# EAGLE design stepper_counter (EAGLE 9.6.2)
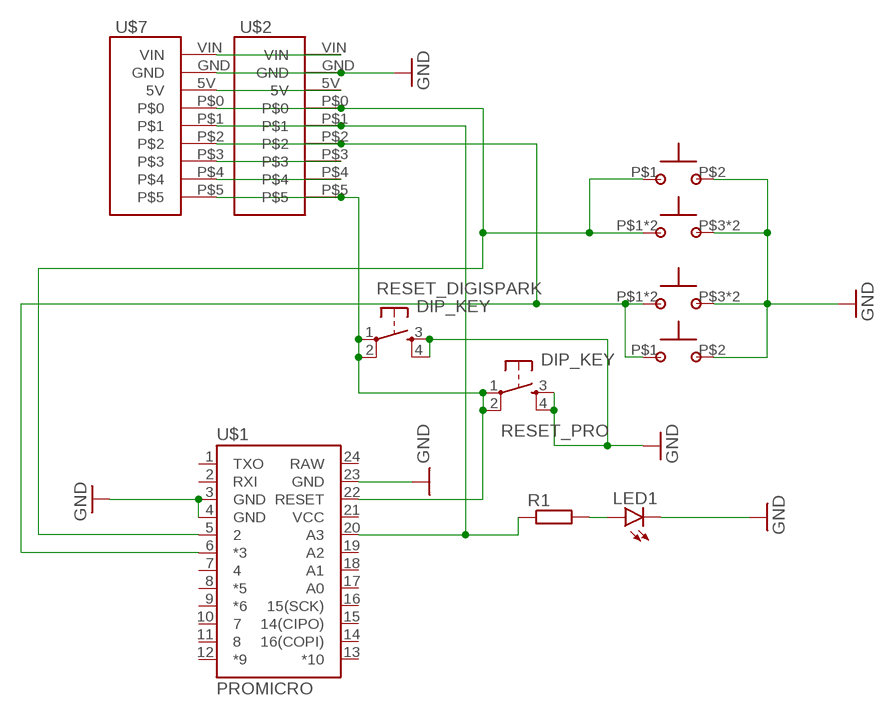
[diagram p0: schematic, sheet 1]

## Parts
LED1  LED3MM  [LED3MM]
R1  R-EU_0207/10  [0207/10]
RESET_DIGISPARK  DIP_KEY  [B3F-10XX]
RESET_PRO  DIP_KEY  [B3F-10XX]
U$1  PROMICRO  [SPARKFUN_PRO_MICRO]
U$2  DIGISPARK  [DIGISPARK]
U$3  RBS040210  [RBS040210]
U$4  RBS040210  [RBS040210]
U$5  SW20D  [SW20D]
U$6  SW20D  [SW20D]
U$7  DIGISPARK_USB  [DIGISPARK_USB]

## Nets
GND: LED1.K(C) RESET_DIGISPARK.3(S) RESET_DIGISPARK.4(S1) RESET_PRO.3(S) RESET_PRO.4(S1) U$1.3(GND) U$1.4(GND) U$1.23(GND) U$2.GND U$3.P$3 U$3.P$4 U$4.P$3 U$4.P$4 U$5.P$2 U$6.P$2 U$7.GND
N$1: R1.1 U$1.20(A3) U$2.P$1 U$7.P$1
N$2: LED1.A R1.2
N$3: RESET_DIGISPARK.1(P) RESET_DIGISPARK.2(P1) RESET_PRO.1(P) RESET_PRO.2(P1) U$1.22(RESET) U$2.P$5 U$7.P$5
N$4: U$2.VIN U$7.VIN
N$5: U$2.5V U$7.5V
N$6: U$2.P$3 U$7.P$3
N$7: U$1.6(*3) U$2.P$2 U$4.P$1 U$4.P$2 U$6.P$1 U$7.P$2
N$8: U$1.5 U$2.P$0 U$3.P$1 U$3.P$2 U$5.P$1 U$7.P$0
N$9: U$2.P$4 U$7.P$4
Unconnected: U$1.1(TXO) U$1.2(RXI) U$1.7 U$1.8(*5) U$1.9(*6) U$1.10 U$1.11 U$1.12(*9) U$1.13(*10) U$1.14(16(COPI)) U$1.15(14(CIPO)) U$1.16(15(SCK)) U$1.17(A0) U$1.18(A1) U$1.19(A2)

## Power pins joined to a net without a drawn wire
RAW: U$1.24(RAW)
VCC: U$1.21(VCC)

## Library data of the parts
LED1 = for_key:LED: LED OSRAM: - CHIPLED LG R971, LG N971, LY N971, LG Q971, LY Q971, LO R971, LY R971 LH N974, LH R974 LS Q976, LO Q976, LY Q976 LO Q996 - Hyper CHIPLED LW Q18S LB Q993, LB Q99A, LB R99A - SideLED LS A670, LO A670, LY A670, LG A670, LP A670 LB A673, LV A673, LT A673, LW A673 LH A674 LY A675 LS A676, LA A676, LO A676, LY A676, LW A676 LS A679, LY A679, LG A679 - Hyper Micro SIDELED® LS Y876, LA Y876, LO Y876, LY Y876 LT Y87S - SmartLED LW L88C, LW L88S LB L89C, LB L89S, LG L890 LS L89K, LO L89K, LY L89K LS L896, LA L896, LO L896, LY L896 - TOPLED LS T670, LO T670, LY T670, LG T670, LP T670 LSG T670, LSP T670, LSY T670, LOP T670, LYG T670 LG T671, LOG T671, LSG T671 LB T673, LV T673, LT T673, LW T673 LH T674 LS T676, LA T676, LO T676, LY T676, LB T676, LH T676, LSB T676, LW T676 LB T67C, LV T67C, LT T67C, LS T67K, LO T67K, LY T67K, LW E67C LS E67B, LA E67B, LO E67B, LY E67B, LB E67C, LV E67C, LT E67C LW T67C LS T679, LY T679, LG T679 LS T770, LO T770, LY T770, LG T770, LP T770 LB T773, LV T773, LT T773, LW T773 LH T774 LS E675, LA E675, LY E675, LS T675 LS T776, LA T776, LO T776, LY T776, LB T776 LHGB T686 LT T68C, LB T68C - Hyper Mini TOPLED® LB M676 - Mini TOPLED Santana® LG M470 LS M47K, LO M47K, LY M47K Source: http://www.osram.convergy.de LUXEON: - LUMILED® LXK2-PW12-R00, LXK2-PW12-S00, LXK2-PW14-U00, LXK2-PW14-V00 LXK2-PM12-R00, LXK2-PM12-S00, LXK2-PM14-U00 LXK2-PE12-Q00, LXK2-PE12-R00, LXK2-PE12-S00, LXK2-PE14-T00, LXK2-PE14-U00 LXK2-PB12-K00, LXK2-PB12-L00, LXK2-PB12-M00, LXK2-PB14-N00, LXK2-PB14-P00, LXK2-PB14-Q00 LXK2-PR12-L00, LXK2-PR12-M00, LXK2-PR14-Q00, LXK2-PR14-R00 LXK2-PD12-Q00, LXK2-PD12-R00, LXK2-PD12-S00 LXK2-PH12-R00, LXK2-PH12-S00 LXK2-PL12-P00, LXK2-PL12-Q00, LXK2-PL12-R00 Source: www.luxeon.com KINGBRIGHT: KA-3528ASYC Source: www.kingbright.com
R1 = rcl:R-EU_: RESISTOR, European symbol; SPICEPREFIX: R
RESET_DIGISPARK RESET_PRO = for_key:DIP_KEY
U$1 = for_key:PROMICRO
U$2 = for_key:DIGISPARK
U$3 U$4 = for_key:RBS040210
U$5 U$6 = for_key:SW20D
U$7 = for_key:DIGISPARK_USB

## Net classes
0 default: width 0.5 mm, drill 0.3 mm, clearance 0.2 mm

## Board
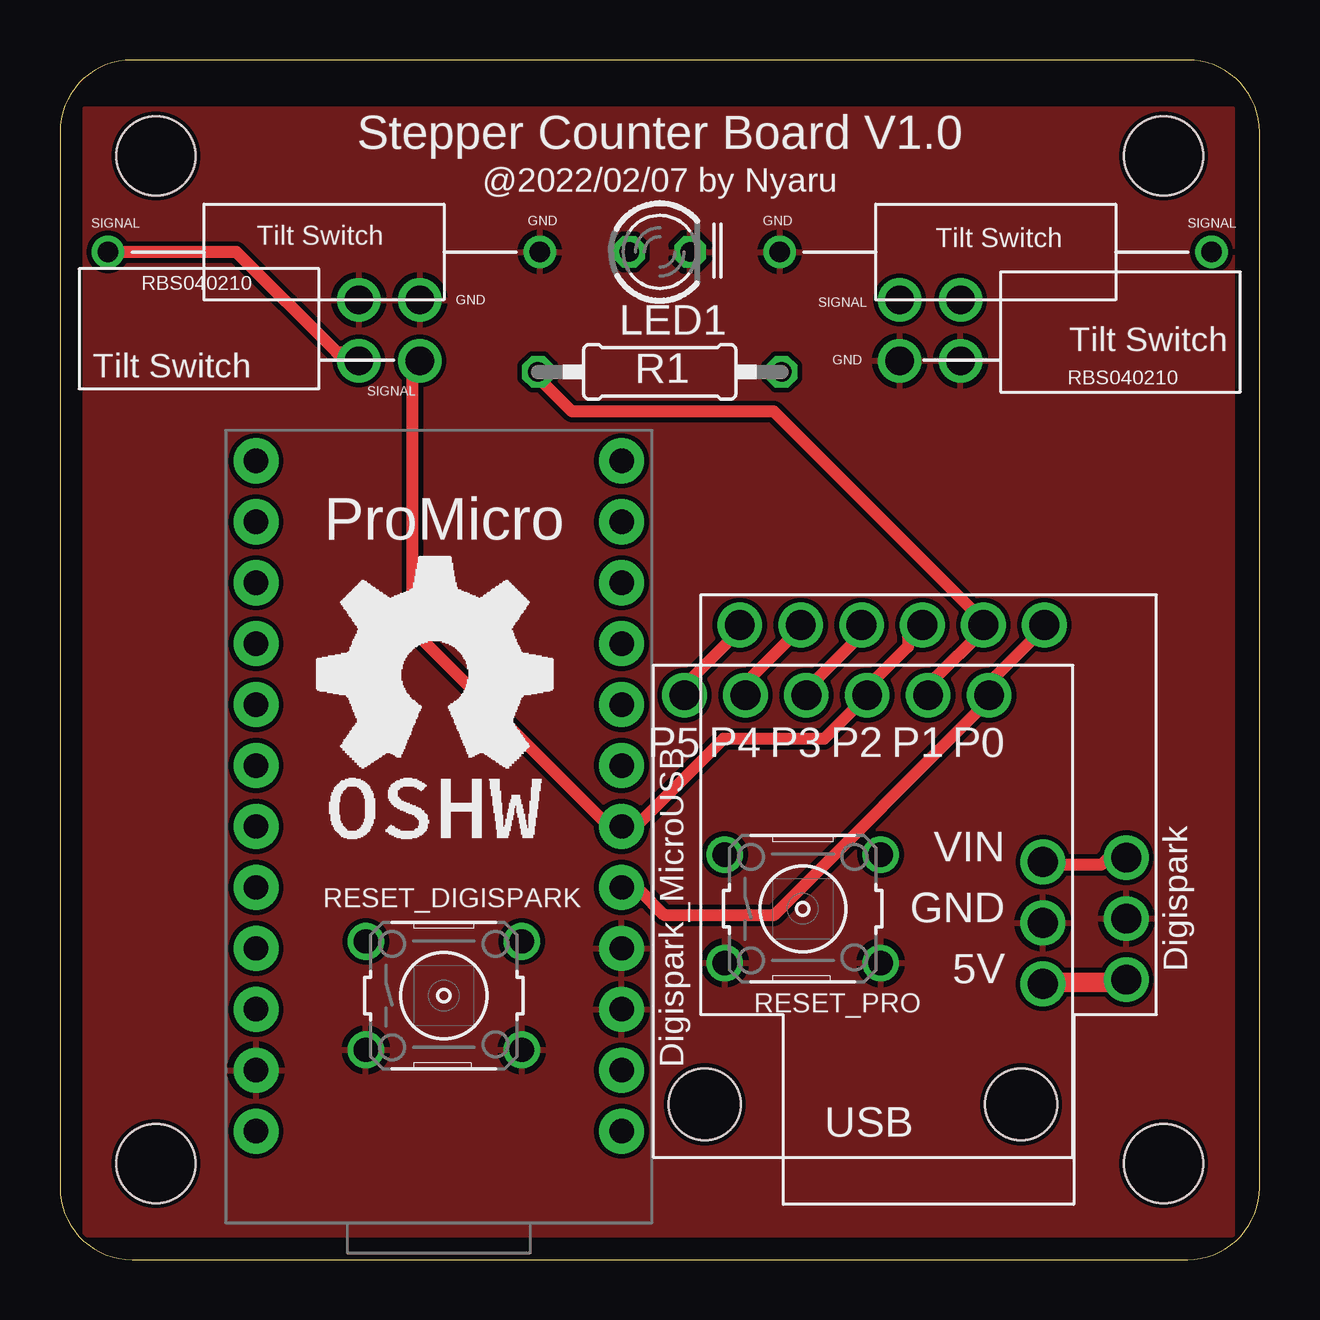
[diagram p1: board, top side]
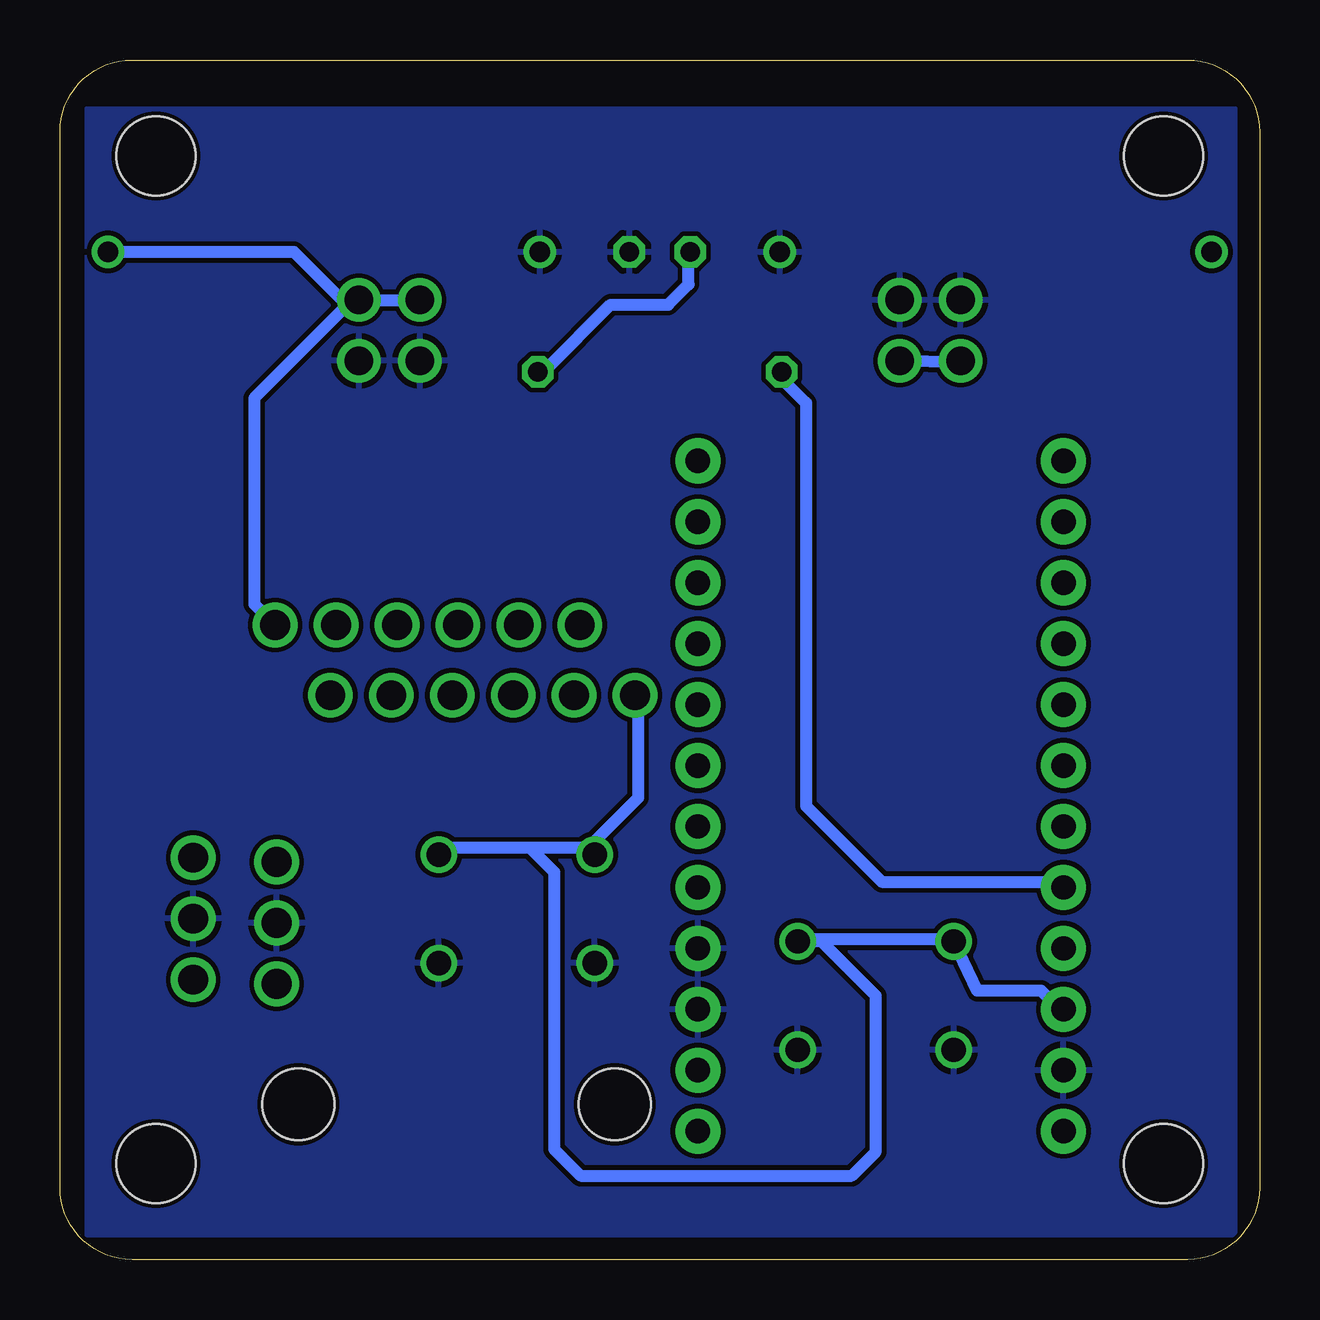
[diagram p2: board, bottom side, seen from below]

Size 50 x 50 mm. Coordinates in mm from the lower left corner, seen from the top.
Outline: 0,47 0,3 arc90 3,0 47,0 arc90 50,3 50,47 arc90 47,50 3,50 arc90 0,47
Copper layers (1*16): Top 0.035mm / dielectric 1.5mm / Bottom 0.035mm
Design rules "PCBGoGo": minimum track width 6mil, minimum drill 0.2mm, track to track 6mil, track to pad 6mil, pad to pad 6mil, via to via 6mil, smd to smd 6mil, copper to edge 0.2mm, drill to drill 6mil, minimum pad ring 10mil, minimum via ring 8mil, stop-mask expansion 4mil, vias tented up to drill 0mil, thermal gap 10mil
Holes 3.3 mm at 4,4 4,46 46,4 46,46

### Footprints (pad centres in the part's own frame; a part is rotated, then mirrored left to right if it is on the bottom)
LED3MM = drill 0.813 octagon: A -1.27,0; K 1.27,0
0207/10 = drill 0.813 octagon: 1 -5.08,0; 2 5.08,0
B3F-10XX = drill 1.016: 1 -3.251,2.261; 2 3.251,2.261; 3 -3.251,-2.261; 4 3.251,-2.261
SPARKFUN_PRO_MICRO = drill 1.016 pad 1.88: 1 -7.62,12.7; 2 -7.62,10.16; 3 -7.62,7.62; 4 -7.62,5.08; 5 -7.62,2.54; 6 -7.62,0; 7 -7.62,-2.54; 8 -7.62,-5.08; 9 -7.62,-7.62; 10 -7.62,-10.16; 11 -7.62,-12.7; 12 -7.62,-15.24; 13 7.62,-15.24; 14 7.62,-12.7; 15 7.62,-10.16; 16 7.62,-7.62; 17 7.62,-5.08; 18 7.62,-2.54; 19 7.62,0; 20 7.62,2.54; 21 7.62,5.08; 22 7.62,7.62; 23 7.62,10.16; 24 7.62,12.7
DIGISPARK = drill 1.24: 5V 1.25,13.28; GND 1.25,10.74; P$0 3.49,1.25; P$1 6.03,1.25; P$2 8.57,1.25; P$3 11.11,1.25; P$4 13.65,1.25; P$5 16.19,1.25; VIN 1.25,8.2 | hole 3: 2.15,18.3; 15.35,18.3
RBS040210 = drill 1.2: P$1 -2.54,2.54; P$2 -2.54,0; P$3 0,0; P$4 0,2.54
SW20D = drill 0.85: P$1 -9,0; P$2 9,0
DIGISPARK_USB = drill 1.24: 5V 1.25,16.03; GND 1.25,13.49; P$0 4.67,1.25; P$1 7.21,1.25; P$2 9.75,1.25; P$3 12.29,1.25; P$4 14.83,1.25; P$5 17.37,1.25; VIN 1.25,10.95

### Placement (x,y rotation side)
LED1  25,42 0 top
R1  25,37 0 top
RESET_DIGISPARK  16,11 0 top
RESET_PRO  30.96,14.62 0 top
U$1  15.79,18.05 180 top
U$2  42.22,24.77 180 top
U$3  35,37.46 270 top
U$4  15,40 90 top
U$5  39,42 180 top
U$6  11,42 0 top
U$7  45.7,27.7 180 top

### Tracks (layer width: path | path; a pad name or v marks a point on that pad's centre or on a via)
GND
  pour Top: 1,48 1,1 48.9,1 48.9,48
  pour Bottom: 1,48 1,1 48.9,1 48.9,48
N$1
  Top 0.5: R1.1 19.95,36.75 21.35,35.35 29.75,35.35 38.5,26.6 U$7.P$1 38.5,26.25 36.4,24.15 36.4,23.8 U$2.P$1
  Bottom 0.5: U$1.20 8.4,15.75 15.75,15.75 18.9,18.9 18.9,35.7 19.95,36.75 R1.1
N$2
  Bottom 0.5: LED1.A 23.8,42 23.8,40.65 24.65,39.8 27.05,39.8 29.75,37.1 R1.2
N$3
  Top 0.5: U$7.P$5 28,26.25 28,25.9 25.9,23.8 U$2.P$5
  Bottom 0.5: U$1.22 8.05,10.5 8.4,10.85 8.75,10.85 9.1,11.2 11.76,11.2 RESET_DIGISPARK.1 12.84,13.35 19.2,13.35 19.25,13.3 RESET_DIGISPARK.2 18.26,13.26 16,11 16,4.5 17,3.5 28.3,3.5 29.4,4.6 29.4,16.15 30.4,17.15 | 27.65,17.15 27.65,17.5 25.9,19.25 25.9,23.45 U$2.P$5 | 27.65,17.15 RESET_PRO.1 | 30.4,17.15 33.95,17.15 RESET_PRO.2 | 27.65,17.15 30.4,17.15
N$4
  Top 0.5: U$2.VIN 41.3,16.45 43.4,16.45 43.75,16.8 44.45,16.8 U$7.VIN
N$5
  Top 0.5: 41.3,11.55 U$2.5V | 44.45,11.55 U$7.5V
  Top 0.813: 44.45,11.55 41.3,11.55
N$6
  Top 0.5: U$2.P$3 31.15,23.8 33.6,26.25 U$7.P$3
N$7
  Top 0.5: U$6.P$1 7.35,42 11.55,37.8 12.25,37.8 U$4.P$1 | U$7.P$2 35.7,26.6 35.35,26.25 35.35,25.55 33.95,24.15 33.95,23.8 U$2.P$2 33.6,23.45 31.85,21.7 27.65,21.7 24.15,18.2 23.45,18.2 U$1.6 23.1,17.85 14.7,26.25 14.7,37.45 U$4.P$2
  Bottom 0.5: U$4.P$2 12.59,37.38 12.54,37.38 U$4.P$1
N$8
  Top 0.5: U$7.P$0 40.95,26.6 40.6,26.25 40.6,25.9 38.85,24.15 38.85,23.8 U$2.P$0 38.85,23.45 29.75,14.35 25.2,14.35 24.15,15.4 23.45,15.4 U$1.5
  Bottom 0.5: U$5.P$1 40.25,42 38.25,40 | 38.25,40 38.02,39.77 41.9,35.9 41.9,27.32 U$7.P$0 | U$3.P$2 U$3.P$1 38.25,40
N$9
  Top 0.5: U$2.P$4 28.7,23.8 28.7,24.15 30.45,25.9 30.45,26.25 30.8,26.6 U$7.P$4

### Text on the board
tPlace: Stepper Counter Board V1.0 | @2022/02/07 by Nyaru | SIGNAL | GND | GND | SIGNAL | Tilt Switch | Tilt Switch | GND | SIGNAL | Tilt Switch | Tilt Switch | GND | SIGNAL
tNames: ProMicro | Digispark | Digispark_MicroUSB